# Altium schematic sheet CONNECTOR.SchDoc
size A3
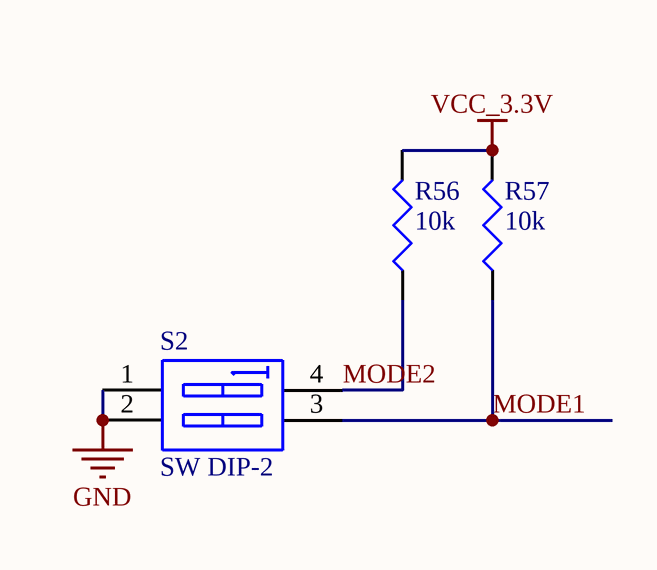
[diagram p0: CONNECTOR.SchDoc]

## Parts
R56  10k  [0603R]
R57  10k  [0603R]
S2  SW DIP-2  [SW_SMT_4]

## Nets
GND: S2.1(A1) S2.2(A2)
VCC_3.3V: R56.2 R57.2
MODE1: R57.1 S2.3(B2)
MODE2: R56.1 S2.4(B1)

## Library data of the parts
R56 R57 = RES1: P: 1/8W
S2 = SW DIP-2: DIP Switch, 2 Position, SPST; Published: 24-Mar-1999; LatestRevisionDate: 17-Jul-2002; LatestRevisionNote: Re-released for DXP Platform.; PackageReference: DIP-4; Publisher: Altium Limited